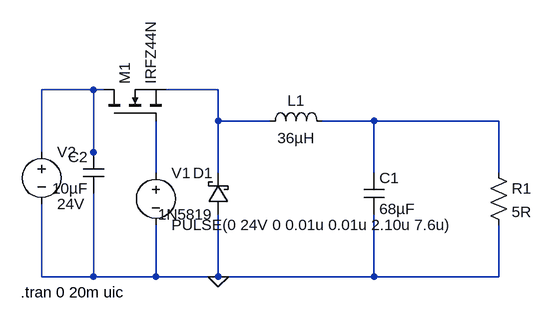
[diagram p0: schematic LT_Spice Simulation.asc]
LT_Spice Simulation.asc, the LTspice schematic file:
Version 4
SHEET 1 880 680
WIRE -240 16 -320 16
WIRE -224 16 -240 16
WIRE -48 16 -128 16
WIRE -48 64 -48 16
WIRE 32 64 -48 64
WIRE 192 64 112 64
WIRE 384 64 192 64
WIRE -320 112 -320 16
WIRE -240 112 -240 16
WIRE -240 128 -240 112
WIRE -144 144 -144 64
WIRE -48 144 -48 64
WIRE 192 144 192 64
WIRE 384 144 384 64
WIRE -320 304 -320 192
WIRE -240 304 -240 176
WIRE -240 304 -320 304
WIRE -144 304 -144 224
WIRE -144 304 -240 304
WIRE -48 304 -48 208
WIRE -48 304 -144 304
WIRE 192 304 192 208
WIRE 192 304 -48 304
WIRE 384 304 384 224
WIRE 384 304 192 304
FLAG -48 304 0
SYMBOL cap 176 144 R0
SYMATTR InstName C1
SYMATTR Value 68µF
SYMBOL res 368 128 R0
SYMATTR InstName R1
SYMATTR Value 5R
SYMBOL nmos -224 64 R270
SYMATTR InstName M1
SYMATTR Value IRFZ44N
SYMBOL schottky -32 208 R180
WINDOW 0 24 64 Left 2
WINDOW 3 24 0 Left 2
SYMATTR InstName D1
SYMATTR Value 1N5819
SYMATTR Description Diode
SYMATTR Type diode
SYMBOL voltage -144 128 R0
WINDOW 123 0 0 Left 0
WINDOW 39 0 0 Left 0
SYMATTR InstName V1
SYMATTR Value PULSE(0 24V 0 0.01u 0.01u 2.10u 7.6u)
SYMBOL voltage -320 96 R0
WINDOW 123 0 0 Left 0
WINDOW 39 0 0 Left 0
SYMATTR InstName V2
SYMATTR Value 24V
SYMBOL ind 16 80 R270
WINDOW 0 32 56 VTop 2
WINDOW 3 5 56 VBottom 2
SYMATTR InstName L1
SYMATTR Value 36µH
SYMBOL cap -224 176 R180
WINDOW 0 24 56 Left 2
WINDOW 3 24 8 Left 2
SYMATTR InstName C2
SYMATTR Value 10µF
TEXT -352 328 Left 2 !.tran 0 20m uic

The netlist it stands for:
* LT_Spice Simulation.asc
C1 N003 0 68µF
R1 N003 0 5R
M1 N001 N004 N002 N002 IRFZ44N
D1 0 N002 1N5819
V1 N004 0 PULSE(0 24V 0 0.01u 0.01u 2.10u 7.6u)
V2 N001 0 24V
L1 N002 N003 36µH
C2 0 N001 10µF
.model D D
.lib standard.dio
.model NMOS NMOS
.model PMOS PMOS
.lib standard.mos
.tran 0 20m uic
.backanno
.end